# EAGLE design demon_ test (EAGLE 9.6.2)
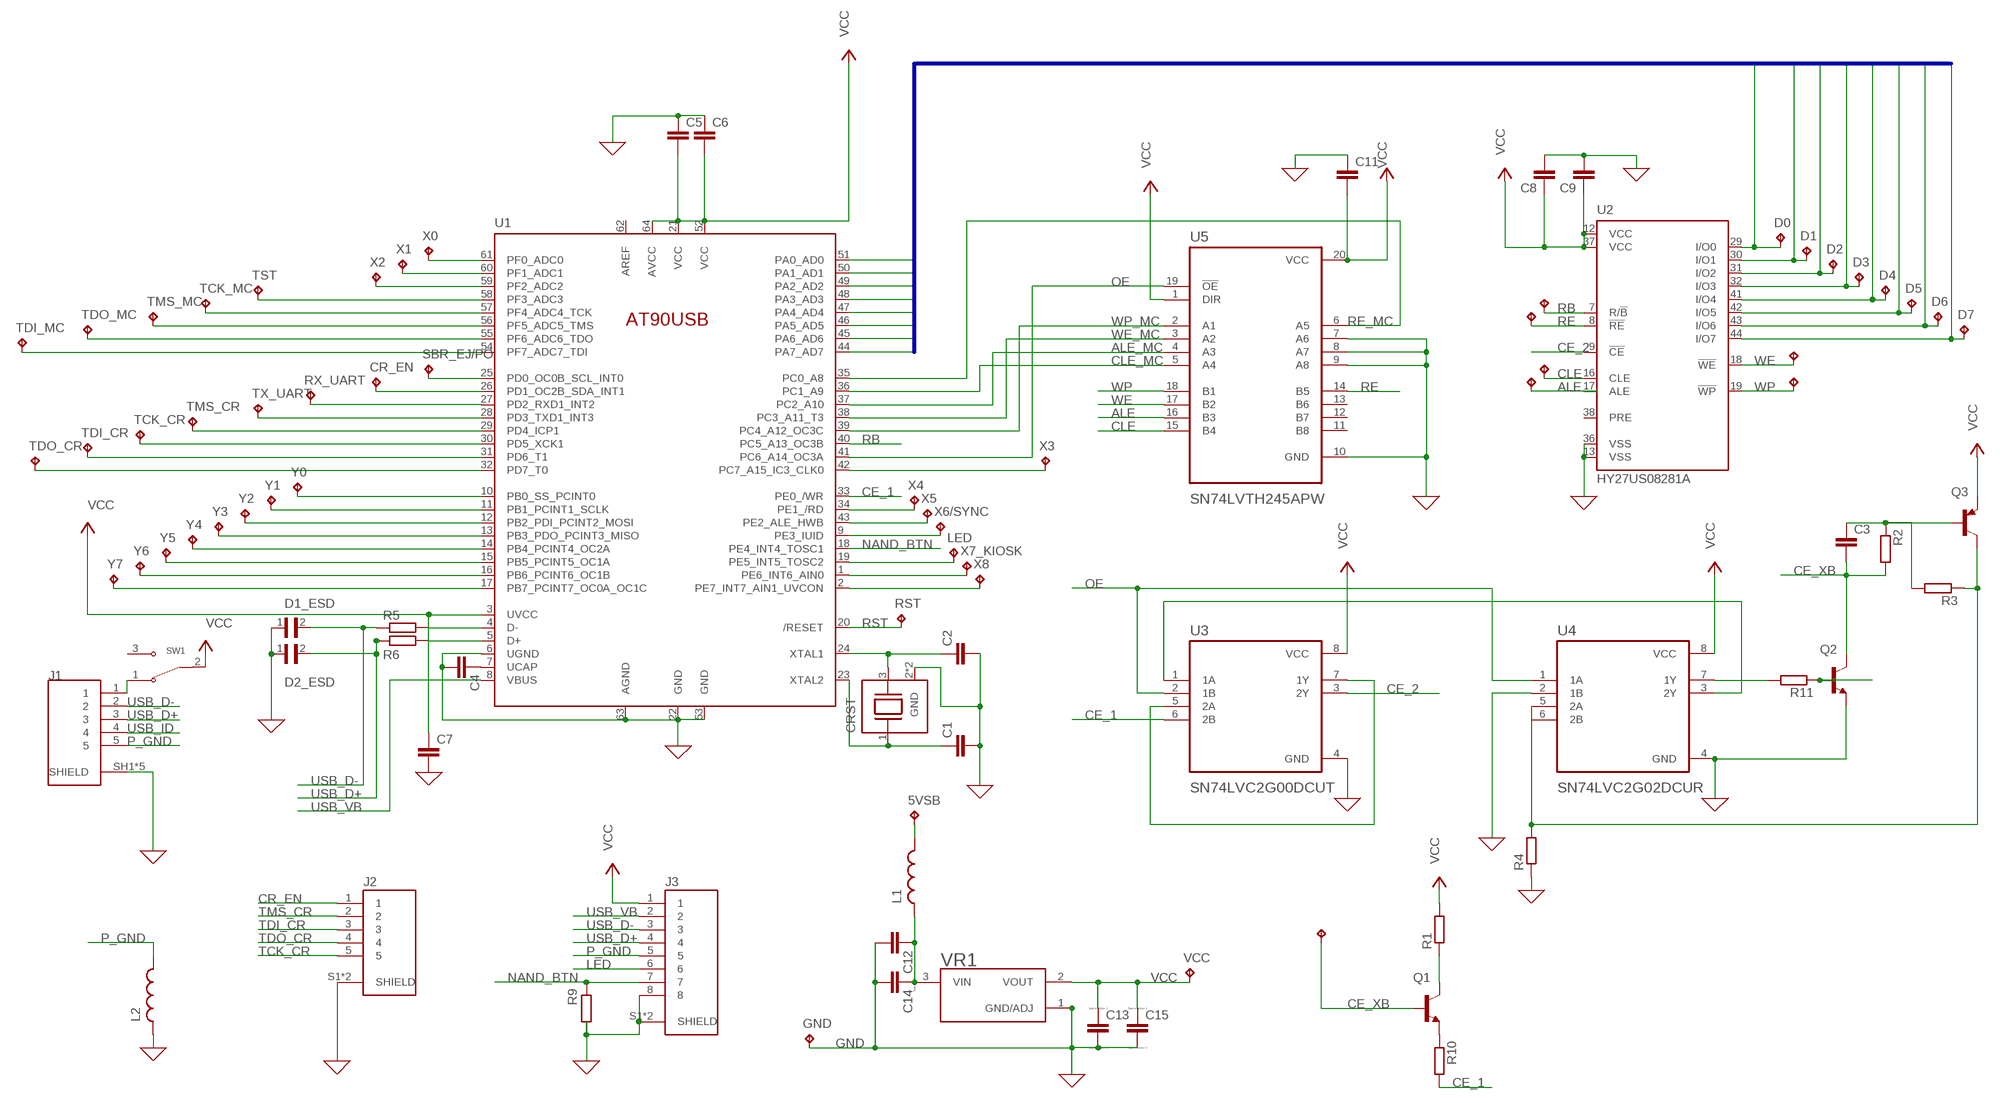
[diagram p0: schematic, sheet 1]

## Parts
5VSB  TPTP20R  [TP20R]
ALE1  TPTP15R  [TP15R]
C1  18pf  C-EUC0603  [C0603]
C2  18pf  C-EUC0603  [C0603]
C3  47pf  C-EUC0603  [C0603]
C4  1uf  C-EUC0603  [C0603]
C5  .1uf  C-EUC0603  [C0603]
C6  .1uf  C-EUC0603  [C0603]
C7  .1uf  C-EUC0603  [C0603]
C8  .1uf  C-EUC0603  [C0603]
C9  .1uf  C-EUC0603  [C0603]
C11  1uf  C-EUC0603  [C0603]
C12  .1uf  C-EUC0603  [C0603]
C13  2.2uf tant  CC2012  [C2012]
C14  1uf tant  CC2012  [C2012]
C15  10uf Tant  CC2012  [C2012]
CE  TPTP15R  [TP15R]
CLE1  TPTP15R  [TP15R]
CR_EN  TPTP15R  [TP15R]
CRST  ABMM2-8.000MHZ-E2-T  [XTAL_ABMM2-8.000MHZ-E2-T]
D0  TPTP15R  [TP15R]
D1  TPTP15R  [TP15R]
D1_ESD  PGB1010603  [ESD_PGB1010603MR]
D2  TPTP15R  [TP15R]
D2_ESD  PGB1010603  [ESD_PGB1010603MR]
D3  TPTP15R  [TP15R]
D4  TPTP15R  [TP15R]
D5  TPTP15R  [TP15R]
D6  TPTP15R  [TP15R]
D7  TPTP15R  [TP15R]
GND  TPTP15R  [TP15R]
J1  UJ2-MIBH2-4-SMT  [CUI_UJ2-MIBH2-4-SMT]
J2  FFC3B07-05-T  [GCT_FFC3B07-05-T]
J3  FFC3B07-08-T  [GCT_FFC3B07-08-T]
L1  LQW2BAS6N8J00L  [INDC2015X152N]
L2  LQW2BAS6N8J00L  [INDC2015X152N]
LED  TPTP15R  [TP15R]
Q1  BC846  [SOT23]
Q2  BC846  [SOT23]
Q3  bc856  BC856A-PNP-SOT23-BEC  [SOT23-BEC]
R1  22R 5%  R-EU_R0603  [R0603]
R2  470R 5%  R-EU_R0603  [R0603]
R3  2k7R 5%  R-EU_R0603  [R0603]
R4  330R 5%  R-EU_R0603  [R0603]
R5  22r 5%  R-EU_R0603  [R0603]
R6  22R 5%  R-EU_R0603  [R0603]
R9  10kR 5%  R-EU_R0603  [R0603]
R10  68R 5%  R-EU_R0603  [R0603]
R11  680R 5%  R-EU_R0603  [R0603]
RB1  TPTP15R  [TP15R]
RE  TPTP15R  [TP15R]
RST  TPTP15R  [TP15R]
RX_UART  TPTP15R  [TP15R]
SBR_EJ/PO  TPTP15R  [TP15R]
SW1  EG1215AA  [SW_EG1215AA]
TCK_CR  TPTP15R  [TP15R]
TCK_MC  TPTP15R  [TP15R]
TDI_CR  TPTP15R  [TP15R]
TDI_MC  TPTP15R  [TP15R]
TDO_CR  TPTP15R  [TP15R]
TDO_MC  TPTP15R  [TP15R]
TMS_CR  TPTP15R  [TP15R]
TMS_MC  TPTP15R  [TP15R]
TST  TPTP15R  [TP15R]
TX_UART  TPTP15R  [TP15R]
U1  AT90USB-QFN  [QFN64]
U2  HY27US08281A  [TSOP48]
U3  SN74LVC2G00DCUT  [SOP50P310X90-8N]
U4  SN74LVC2G02DCUR  [SOP50P310X90-8N]
U5  SN74LVTH245APW  [SOP65P640X120-20N]
VCC  TPTP15R  [TP15R]
VR1  AMS1117-3.3  [SOT229P700X180-4N]
WE1  TPTP15R  [TP15R]
WP1  TPTP15R  [TP15R]
X0  TPTP15R  [TP15R]
X1  TPTP15R  [TP15R]
X2  TPTP15R  [TP15R]
X3  TPTP15R  [TP15R]
X4  TPTP15R  [TP15R]
X5  TPTP15R  [TP15R]
X6/SYNC  TPTP15R  [TP15R]
X7_KIOSK  TPTP15R  [TP15R]
X8  TPTP15R  [TP15R]
Y0  TPTP15R  [TP15R]
Y1  TPTP15R  [TP15R]
Y2  TPTP15R  [TP15R]
Y3  TPTP15R  [TP15R]
Y4  TPTP15R  [TP15R]
Y5  TPTP15R  [TP15R]
Y6  TPTP15R  [TP15R]
Y7  TPTP15R  [TP15R]

## Nets
0: C7.2 U5.7(A6) U5.8(A7) U5.9(A8) U5.10(GND) ; supply symbol labelled GND
ALE: ALE1.TP U2.17(ALE) U5.16(B3)
ALE_MC: U1.37(PC2_A10) U5.4(A3)
CE_1: R10.2 U1.33(PE0_/WR) U3.6(2B)
CE_2: U2.9(!CE) U3.3(2Y)
CE_XB: C3.2 CE.TP Q1.1(B) Q2.3(C) R2.2
CLE: CLE1.TP U2.16(CLE) U5.15(B4)
CLE_MC: U1.36(PC1_A9) U5.5(A4)
CR_EN: CR_EN.TP J2.1 U1.26(PD1_OC2B_SDA_INT1)
D0: D0.TP U1.51(PA0_AD0) U2.29(I/O0)
D1: D1.TP U1.50(PA1_AD1) U2.30(I/O1)
D2: D2.TP U1.49(PA2_AD2) U2.31(I/O2)
D3: D3.TP U1.48(PA3_AD3) U2.32(I/O3)
D4: D4.TP U1.47(PA4_AD4) U2.41(I/O4)
D5: D5.TP U1.46(PA5_AD5) U2.42(I/O5)
D6: D6.TP U1.45(PA6_AD6) U2.43(I/O6)
D7: D7.TP U1.44(PA7_AD7) U2.44(I/O7)
F_5VSB: C12.1 C14.1 L1.1 VR1.3(VIN)
GND: C1.2 C2.2 C4.2 C5.1 C6.1 C8.2 C9.2 C11.1 C12.2 C13.2 C14.2 C15.2 CRST.2(GND) CRST.4(GND) D1_ESD.1 D2_ESD.1 GND.TP J1.SH1(SHIELD) J1.SH2(SHIELD) J1.SH3(SHIELD) J1.SH4(SHIELD) J1.SH5(SHIELD) J2.S1(SHIELD) J2.S2(SHIELD) J3.8 J3.S1(SHIELD) J3.S2(SHIELD) L2.1 Q2.2(E) R4.1 R9.2 U1.6(UGND) U1.22(GND) U1.53(GND) U1.63(AGND) U2.13(VSS) U2.36(VSS) U3.4(GND) U4.2(1B) U4.4(GND) VR1.1(GND/ADJ)
LED: J3.6 LED.TP U1.19(PE5_INT5_TOSC2)
N$1: R5.2 U1.4(D-)
N$2: C3.1 Q3.B R2.1 R3.2
N$3: C4.1 U1.7(UCAP)
N$4: R6.2 U1.5(D+)
N$6: Q1.3(C) R1.1
N$7: Q1.2(E) R10.1
N$8: 5VSB.TP L1.2
N$20: U3.5(2A) U3.7(1Y)
N$32: U3.1(1A) U4.3(2Y)
N$33: R11.2 U4.7(1Y)
N$34: Q2.1(B) R11.1
N$36: Q3.C R3.1 R4.2 U4.5(2A) U4.6(2B)
N$37: J1.1 SW1.1
NAND_BTN: J3.7 R9.1 U1.18(PE4_INT4_TOSC1)
OE: U1.41(PC6_A14_OC3A) U3.2(1B) U4.1(1A) U5.19(!OE)
P_GND: J1.5 J3.5 L2.2
RB: RB1.TP U1.40(PC5_A13_OC3B) U2.7(R/!B)
RE: RE.TP U2.8(!RE) U5.14(B5)
RE_MC: U1.35(PC0_A8) U5.6(A5)
RST: RST.TP U1.20(/RESET)
RX_UART: RX_UART.TP U1.27(PD2_RXD1_INT2)
SBR: SBR_EJ/PO.TP U1.25(PD0_OC0B_SCL_INT0)
TCK_CR: J2.5 TCK_CR.TP U1.30(PD5_XCK1)
TCK_MC: TCK_MC.TP U1.57(PF4_ADC4_TCK)
TD0_MC: TDO_MC.TP U1.55(PF6_ADC6_TDO)
TDI_CR: J2.3 TDI_CR.TP U1.31(PD6_T1)
TDI_MC: TDI_MC.TP U1.54(PF7_ADC7_TDI)
TDO_CR: J2.4 TDO_CR.TP U1.32(PD7_T0)
TMS_CR: J2.2 TMS_CR.TP U1.29(PD4_ICP1)
TMS_MC: TMS_MC.TP U1.56(PF5_ADC5_TMS)
TST: TST.TP U1.58(PF3_ADC3)
TX_UART: TX_UART.TP U1.28(PD3_TXD1_INT3)
USB_D+: D2_ESD.2 J1.3 J3.4 R6.1
USB_D-: D1_ESD.2 J1.2 J3.3 R5.1
USB_ID: J1.4
USB_VB: J3.2 U1.8(VBUS)
VCC: C5.2 C6.2 C7.1 C8.1 C9.1 C11.2 C13.1 C15.1 J3.1 Q3.E R1.2 SW1.2 U1.3(UVCC) U1.21(VCC) U1.52(VCC) U1.64(AVCC) U2.12(VCC) U2.37(VCC) U3.8(VCC) U4.8(VCC) U5.1(DIR) U5.20(VCC) VCC.TP VR1.2(VOUT)
WE: U2.18(!WE) U5.17(B2) WE1.TP
WE_MC: U1.38(PC3_A11_T3) U5.3(A2)
WP: U2.19(!WP) U5.18(B1) WP1.TP
WP_MC: U1.39(PC4_A12_OC3C) U5.2(A1)
X0: U1.61(PF0_ADC0) X0.TP
X1: U1.60(PF1_ADC1) X1.TP
X2: U1.59(PF2_ADC2) X2.TP
X3: U1.42(PC7_A15_IC3_CLK0) X3.TP
X4: U1.34(PE1_/RD) X4.TP
X5: U1.43(PE2_ALE_HWB) X5.TP
X6/SYNC: U1.9(PE3_IUID) X6/SYNC.TP
X7: U1.1(PE6_INT6_AIN0) X7_KIOSK.TP
X8: U1.2(PE7_INT7_AIN1_UVCON) X8.TP
XTAL1: C2.1 CRST.3 U1.24(XTAL1)
XTAL2: C1.1 CRST.1 U1.23(XTAL2)
Y0: U1.10(PB0_SS_PCINT0) Y0.TP
Y1: U1.11(PB1_PCINT1_SCLK) Y1.TP
Y2: U1.12(PB2_PDI_PCINT2_MOSI) Y2.TP
Y3: U1.13(PB3_PDO_PCINT3_MISO) Y3.TP
Y4: U1.14(PB4_PCINT4_OC2A) Y4.TP
Y5: U1.15(PB5_PCINT5_OC1A) Y5.TP
Y6: U1.16(PB6_PCINT6_OC1B) Y6.TP
Y7: U1.17(PB7_PCINT7_OC0A_OC1C) Y7.TP
Unconnected: SW1.3 U2.38(PRE) U5.11(B8) U5.12(B7) U5.13(B6)

## Buses
NAND_ADDRESS_BUS:D0,D1,D2,D3,D4,D5,D6,D7

## Power pins joined to a net without a drawn wire
AREF: U1.62(AREF)

## Library data of the parts
5VSB ALE1 CE CLE1 CR_EN D0 D1-D7 GND LED RB1 RE RST RX_UART SBR_EJ/PO TCK_CR TCK_MC TDI_CR TDI_MC TDO_CR TDO_MC TMS_CR TMS_MC TST TX_UART VCC WE1 WP1 X0 X1-X5 X6/SYNC X7_KIOSK X8 Y0 Y1-Y7 = testpad:TP: Test pad
C1-C9 C11 C12 = rcl:C-EU: CAPACITOR, European symbol; SPICEPREFIX: C
C13-C15 = eagle-ltspice:C: CAPACITOR, European symbol; SPICEMODEL: NONE; SPICEPREFIX: C
CRST = ABMM2-8.000MHZ-E2-T:ABMM2-8.000MHZ-E2-T: Check availability <https://pricing.snapeda.com/parts/ABMM2-8.000MHZ-E2-T/Abracon/view-part?ref=eda>; AVAILABILITY: In Stock; DESCRIPTION: 8 MHz ±20ppm Crystal 18pF 72 Ohms 4-SMD, No Lead; MF: Abracon; MP: ABMM2-8.000MHZ-E2-T; PACKAGE: SMD-4 Abracon; PRICE: None; PURCHASE-URL: https://pricing.snapeda.com/search/part/ABMM2-8.000MHZ-E2-T/?ref=eda
D1_ESD D2_ESD = PGB1010603:PGB1010603: DIODE, TVS; No. of Pins:2; SVHC:No SVHC (18-Jun-2012); Capacitance Cd @ Vr Typ:0.06pF; Diode Type:TVS; Package / Case:0603; Stand-off Voltage:24V; Termination Type:SMD Check availability <https://pricing.snapeda.com/parts/PGB1010603/Littelfuse%20Inc./view-part?ref=eda>; AVAILABILITY: In Stock; DESCRIPTION: 150V (Typ) Clamp - Ipp Tvs Diode Surface Mount 0603 (1608 Metric); MF: Littelfuse Inc.; MP: PGB1010603; PACKAGE: 0603 Littelfuse Inc.; PRICE: None; PURCHASE-URL: https://pricing.snapeda.com/search/part/PGB1010603/?ref=eda
J1 = UJ2-MIBH2-4-SMT:UJ2-MIBH2-4-SMT: Micro B, USB 2.0, 1.8 A, Right Angle, Surface Mount (SMT), USB Receptacle Check availability <https://pricing.snapeda.com/parts/UJ2-MIBH2-4-SMT/CUI%20Devices/view-part?ref=eda>; AVAILABILITY: In Stock; CUI_PURCHASE_URL: https://www.cuidevices.com/product/interconnect/connectors/usb-connectors/uj2-mibh2-4-smt?utm_source=snapeda.com&utm_medium=referral&utm_campaign=snapedaBOM; DESCRIPTION: Micro B, USB 2.0, 1.8 A, Right Angle, Surface Mount (SMT), USB Receptacle; MF: CUI Devices; MP: UJ2-MIBH2-4-SMT; PACKAGE: None; PRICE: None; PURCHASE-URL: https://pricing.snapeda.com/search/part/UJ2-MIBH2-4-SMT/?ref=eda
J2 = FFC3B07-05-T:FFC3B07-05-T: FPC 1.0mm Pitch, Side entry, Top contact, SMT, Height 2.5mm, Slide type Check availability <https://pricing.snapeda.com/parts/FFC3B07-05-T/Global%20Connector%20Technology/view-part?ref=eda>; AVAILABILITY: In Stock; DESCRIPTION: 5 Position FFC, FPC Connector Contacts, Bottom 0.039 (1.00mm) Surface Mount, Right Angle; MF: Global Connector Technology; MP: FFC3B07-05-T; PACKAGE: None; PRICE: None; PURCHASE-URL: https://pricing.snapeda.com/search/part/FFC3B07-05-T/?ref=eda
J3 = FFC3B07-08-T:FFC3B07-08-T: FPC 1.0mm Pitch, Side entry, Top contact, SMT, Height 2.5mm, Slide type Check availability <https://pricing.snapeda.com/parts/FFC3B07-08-T/Global%20Connector%20Technology/view-part?ref=eda>; AVAILABILITY: In Stock; DESCRIPTION: 8 Position FFC, FPC Connector Contacts, Bottom 0.039 (1.00mm) Surface Mount, Right Angle; MF: Global Connector Technology; MP: FFC3B07-08-T; PACKAGE: None; PRICE: None; PURCHASE-URL: https://pricing.snapeda.com/search/part/FFC3B07-08-T/?ref=eda
L1 L2 = LQW2BAS6N8J00L:LQW2BAS6N8J00L: Ind RF Chip Wirewound 6.8nH 5% 250MHz 50Q-Factor 600mA 0805 Embossed T/R Check availability <https://pricing.snapeda.com/parts/LQW2BAS6N8J00L/Murata/view-part?ref=eda>; AVAILABILITY: In Stock; DESCRIPTION: Inductor with Inductance: 6.8nH Tol. +/-5%, Package: 0805 (2015); MF: Murata; MP: LQW2BAS6N8J00L; PACKAGE: 2015 Murata; PRICE: None; PURCHASE-URL: https://pricing.snapeda.com/search/part/LQW2BAS6N8J00L/?ref=eda
Q1 Q2 = transistor:BC846: NPN TRANSISTOR
Q3 = transistor:*-PNP-: PNP Transistror
R1-R6 R9-R11 = resistor:R-EU_: RESISTOR, European symbol
SW1 = EG1215AA:EG1215AA: Slide Switch SPDT Surface Mount, Right Angle Check availability <https://pricing.snapeda.com/parts/EG1215AA/E-Switch/view-part?ref=eda>; AVAILABILITY: In Stock; DESCRIPTION: Slide Switch SPDT Surface Mount, Right Angle; MF: E-Switch; MP: EG1215AA; PACKAGE: None; PRICE: None; PURCHASE-URL: https://pricing.snapeda.com/search/part/EG1215AA/?ref=eda
U1 = controller-micro_atmel_jd:AT90USB
U2 = memory-hynix:HY27US08281A: HYNIX NAND FLASH HY27US08281A 16Mx8bit with spare 4M bit capacity. Source: http://www.hynix.com/datasheet/pdf/flash/HY27US(08_16)281A%20Series(Rev0.6).pdf
U3 = SN74LVC2G00DCUT:SN74LVC2G00DCUT: Check availability <https://pricing.snapeda.com/parts/SN74LVC2G00DCUT/Texas%20Instruments/view-part?ref=eda>; AVAILABILITY: In Stock; DESCRIPTION: 2-ch, 2-input, 1.65-V to 5.5-V NAND gates; MF: Texas Instruments; MP: SN74LVC2G00DCUT; PACKAGE: VSSOP-8 Texas Instruments; PRICE: None; PURCHASE-URL: https://pricing.snapeda.com/search/part/SN74LVC2G00DCUT/?ref=eda
U4 = SN74LVC2G02DCUR:SN74LVC2G02DCUR: Check availability <https://pricing.snapeda.com/parts/SN74LVC2G02DCUR/Texas%20Instruments/view-part?ref=eda>; AVAILABILITY: In Stock; DESCRIPTION: 2-ch, 2-input, 1.65-V to 5.5-V NOR gates; MF: Texas Instruments; MP: SN74LVC2G02DCUR; PACKAGE: VSSOP-8 Texas Instruments; PRICE: None; PURCHASE-URL: https://pricing.snapeda.com/search/part/SN74LVC2G02DCUR/?ref=eda
U5 = SN74LVTH245APW:SN74LVTH245APW: Check availability <https://pricing.snapeda.com/parts/SN74LVTH245APW/Texas%20Instruments/view-part?ref=eda>; AVAILABILITY: In Stock; DESCRIPTION: 3.3-V ABT Octal Bus Transceivers With 3-State Outputs; MF: Texas Instruments; MP: SN74LVTH245APW; PACKAGE: TSSOP-20 Texas Instruments; PRICE: None; PURCHASE-URL: https://pricing.snapeda.com/search/part/SN74LVTH245APW/?ref=eda
VR1 = AMS1117-3.3:AMS1117-3.3: Check availability <https://pricing.snapeda.com/parts/AMS1117-3.3/Advanced%20Monolithic%20Systems/view-part?ref=eda>; AVAILABILITY: In Stock; DESCRIPTION: Sot223/Pkg 1-Amp 3.3-Volt Low Drop Out Voltage Regulatator; MF: Advanced Monolithic Systems; MP: AMS1117-3.3; PACKAGE: SOT-223 Seeed Technology; PRICE: None; PURCHASE-URL: https://pricing.snapeda.com/search/part/AMS1117-3.3/?ref=eda

## Board
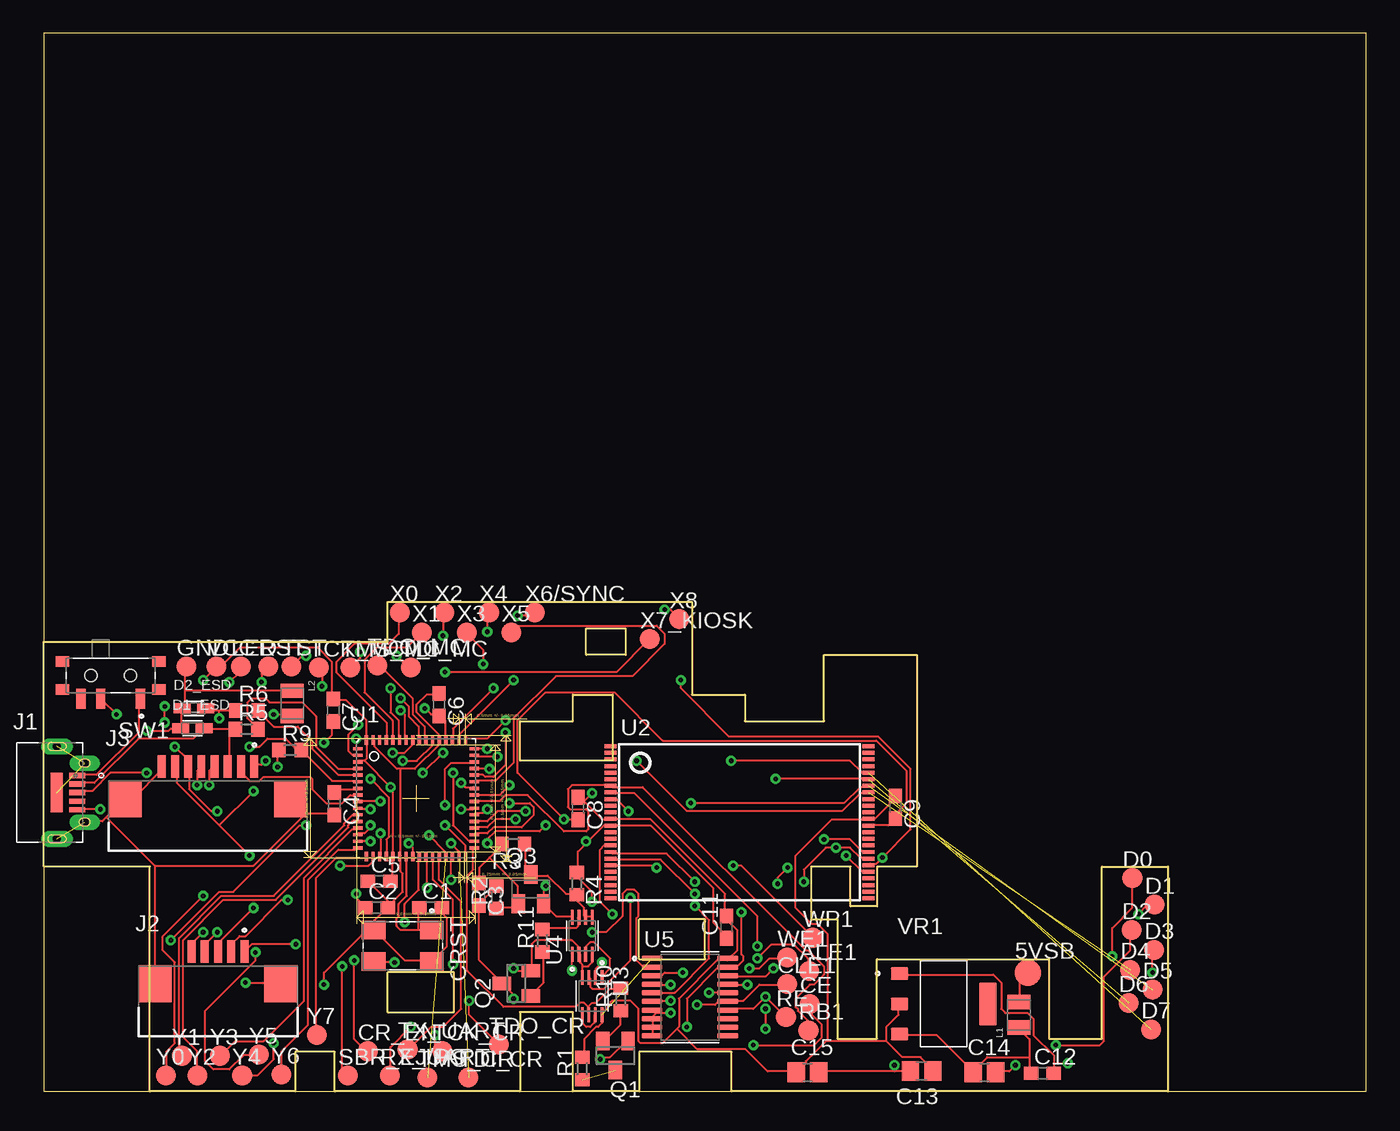
[diagram p1: board, top side]
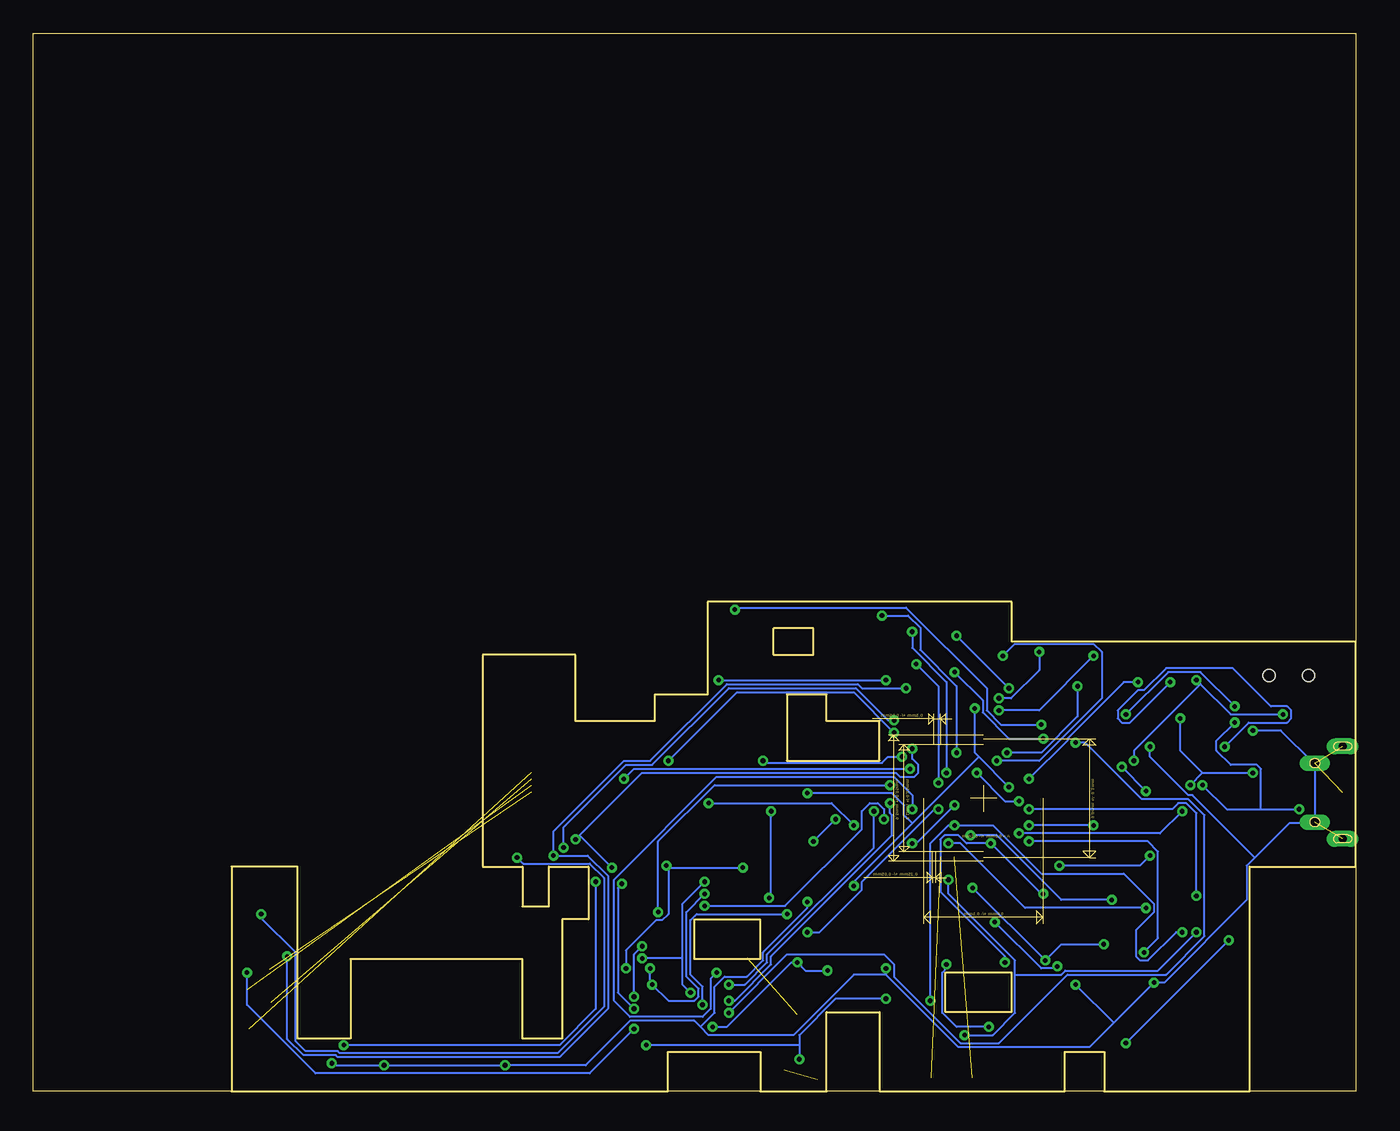
[diagram p2: board, bottom side, seen from below]

Size 100 x 80 mm. Coordinates in mm from the lower left corner, seen from the top.
Outline: 0,0 100,0 100,80 0,80 0,0
Copper layers (1*16): Top 0.035mm / dielectric 1.5mm / Bottom 0.035mm
Design rules "default": minimum track width 6mil, minimum drill 0.35mm, track to track 6mil, track to pad 6mil, pad to pad 6mil, via to via 6mil, smd to smd 6mil, copper to edge 40mil, drill to drill 6mil, minimum pad ring 10mil, minimum via ring 8mil, stop-mask expansion 4mil, vias tented up to drill 0mil, thermal gap 10mil
tRestrict: 61 lines
bRestrict: 60 lines
Milling: 60 lines

### Footprints (pad centres in the part's own frame; a part is rotated, then mirrored left to right if it is on the bottom)
TP20R = smd 2 x 2: TP 0,0
TP15R = smd 1.5 x 1.5: TP 0,0
C0603 = smd 1.1 x 1: 1 -0.85,0; 2 0.85,0
C2012 = smd 1.3 x 1.5: 1 -0.85,0; 2 0.85,0
XTAL_ABMM2-8.000MHZ-E2-T = smd 1.4 x 1.8: 1 -1.2,2.2; 2 -1.2,-2.2; 3 1.2,-2.2; 4 1.2,2.2
ESD_PGB1010603MR = smd 1.27 x 0.76: 1 -0.89,0; 2 0.89,0
CUI_UJ2-MIBH2-4-SMT = smd 1.2 x 0.4: 1 0,0; 2 0,-0.65; 3 0,-1.3; 4 0,-1.95; 5 0,-2.6 | drill 0.6 pad 1.2 long: SH1 -1.55,2.2; SH4 -1.55,-4.8 | drill 0.65 pad 1.05 long: SH2 0.55,0.925; SH5 0.55,-3.525 | smd 0.9 x 3: SH3 -1.55,-1.3
GCT_FFC3B07-05-T = smd 0.6 x 1.7: 1 2,2.45; 2 1,2.45; 3 0,2.45; 4 -1,2.45; 5 -2,2.45 | smd 2.5 x 2.8: S1 4.75,0; S2 -4.75,0
GCT_FFC3B07-08-T = smd 0.6 x 1.7: 1 3.5,2.45; 2 2.5,2.45; 3 1.5,2.45; 4 0.5,2.45; 5 -0.5,2.45; 6 -1.5,2.45; 7 -2.5,2.45; 8 -3.5,2.45 | smd 2.5 x 2.8: S1 6.25,0; S2 -6.25,0
INDC2015X152N = smd 1.09 x 1.75: 1 -0.959,0; 2 0.959,0
SOT23 = smd 1 x 1.4: 1 -0.95,-1.1; 2 0.95,-1.1; 3 0,1.1
SOT23-BEC = smd 1 x 1.4: B -0.95,-1.1; C 0,1.1; E 0.95,-1.1
R0603 = smd 1 x 1.1: 1 -0.85,0; 2 0.85,0
SW_EG1215AA = smd 0.7 x 1.5: 1 -2.25,1.75; 2 0.75,1.75; 3 2.25,1.75 | smd 1 x 0.8: S1 -3.65,1.05; S2 -3.65,-1.05; S3 3.65,-1.05; S4 3.65,1.05 | hole 0.9: -1.5,0; 1.5,0
QFN64 = smd 0.7 x 0.25: 1 -4.4,3.75; 2 -4.4,3.25; 3 -4.4,2.75; 4 -4.4,2.25; 5 -4.4,1.75; 6 -4.4,1.25; 7 -4.4,0.75; 8 -4.4,0.25; 9 -4.4,-0.25; 10 -4.4,-0.75; 11 -4.4,-1.25; 12 -4.4,-1.75; 13 -4.4,-2.25; 14 -4.4,-2.75; 15 -4.4,-3.25; 16 -4.4,-3.75; 33 4.4,-3.75; 34 4.4,-3.25; 35 4.4,-2.75; 36 4.4,-2.25; 37 4.4,-1.75; 38 4.4,-1.25; 39 4.4,-0.75; 40 4.4,-0.25; 41 4.4,0.25; 42 4.4,0.75; 43 4.4,1.25; 44 4.4,1.75; 45 4.4,2.25; 46 4.4,2.75; 47 4.4,3.25; 48 4.4,3.75 | smd 0.25 x 0.7: 17 -3.75,-4.4; 18 -3.25,-4.4; 19 -2.75,-4.4; 20 -2.25,-4.4; 21 -1.75,-4.4; 22 -1.25,-4.4; 23 -0.75,-4.4; 24 -0.25,-4.4; 25 0.25,-4.4; 26 0.75,-4.4; 27 1.25,-4.4; 28 1.75,-4.4; 29 2.25,-4.4; 30 2.75,-4.4; 31 3.25,-4.4; 32 3.75,-4.4; 49 3.75,4.4; 50 3.25,4.4; 51 2.75,4.4; 52 2.25,4.4; 53 1.75,4.4; 54 1.25,4.4; 55 0.75,4.4; 56 0.25,4.4; 57 -0.25,4.4; 58 -0.75,4.4; 59 -1.25,4.4; 60 -1.75,4.4; 61 -2.25,4.4; 62 -2.75,4.4; 63 -3.25,4.4; 64 -3.75,4.4
TSOP48 = smd 0.9 x 0.3: 1 -9.75,5.75; 2 -9.75,5.25; 3 -9.75,4.75; 4 -9.75,4.25; 5 -9.75,3.75; 6 -9.75,3.25; 7 -9.75,2.75; 8 -9.75,2.25; 9 -9.75,1.75; 10 -9.75,1.25; 11 -9.75,0.75; 12 -9.75,0.25; 13 -9.75,-0.25; 14 -9.75,-0.75; 15 -9.75,-1.25; 16 -9.75,-1.75; 17 -9.75,-2.25; 18 -9.75,-2.75; 19 -9.75,-3.25; 20 -9.75,-3.75; 21 -9.75,-4.25; 22 -9.75,-4.75; 23 -9.75,-5.25; 24 -9.75,-5.75; 25 9.75,-5.75; 26 9.75,-5.25; 27 9.75,-4.75; 28 9.75,-4.25; 29 9.75,-3.75; 30 9.75,-3.25; 31 9.75,-2.75; 32 9.75,-2.25; 33 9.75,-1.75; 34 9.75,-1.25; 35 9.75,-0.75; 36 9.75,-0.25; 37 9.75,0.25; 38 9.75,0.75; 39 9.75,1.25; 40 9.75,1.75; 41 9.75,2.25; 42 9.75,2.75; 43 9.75,3.25; 44 9.75,3.75; 45 9.75,4.25; 46 9.75,4.75; 47 9.75,5.25; 48 9.75,5.75
SOP50P310X90-8N = smd 1.12 x 0.27: 1 -1.405,0.75; 2 -1.405,0.25; 3 -1.405,-0.25; 4 -1.405,-0.75; 5 1.405,-0.75; 6 1.405,-0.25; 7 1.405,0.25; 8 1.405,0.75
SOP65P640X120-20N = smd 1.57 x 0.41: 1 -2.87,2.925; 2 -2.87,2.275; 3 -2.87,1.625; 4 -2.87,0.975; 5 -2.87,0.325; 6 -2.87,-0.325; 7 -2.87,-0.975; 8 -2.87,-1.625; 9 -2.87,-2.275; 10 -2.87,-2.925; 11 2.87,-2.925; 12 2.87,-2.275; 13 2.87,-1.625; 14 2.87,-0.975; 15 2.87,-0.325; 16 2.87,0.325; 17 2.87,0.975; 18 2.87,1.625; 19 2.87,2.275; 20 2.87,2.925
SOT229P700X180-4N = smd 1.31 x 0.93: 1 -3.345,2.29; 2 -3.345,0; 3 -3.345,-2.29 | smd 1.31 x 3.24: 4 3.345,0

### Placement (x,y rotation side)
5VSB  74.41,8.96 0 top
ALE1  57.87,9.12 0 top
C1  29.25,13.88 0 top
C2  25.17,13.88 0 top
C3  32.88,14.91 270 top
C4  21.96,21.74 270 top
C5  25.35,15.88 0 top
C6  29.88,29.23 270 top
C7  21.88,28.81 270 top
C8  40.38,21.39 270 top
C9  64.38,21.47 270 top
C11  51.62,12.43 90 top
C12  75.51,1.38 0 top
C13  66.37,1.55 180 top
C14  71.12,1.45 0 top
C15  57.74,1.45 0 top
CE  57.92,6.62 0 top
CLE1  56.22,8.12 0 top
CR_EN  24.49,3.04 0 top
CRST  27.13,11.01 270 top
D0  82.3,16.12 0 top
D1  83.99,14.12 0 top
D1_ESD  11.23,27.45 0 top
D2  82.26,12.2 0 top
D2_ESD  11.34,28.95 0 top
D3  83.95,10.7 0 top
D4  82.14,9.2 0 top
D5  83.83,7.7 0 top
D6  82.02,6.7 0 top
D7  83.71,4.7 0 top
GND  10.79,32.12 0 top
J1  2.53,23.89 0 top
J2  13.17,8.13 0 top
J3  12.41,22.13 0 top
L1  73.72,5.79 90 top
L2  18.78,29.33 270 top
LED  14.89,32.12 0 top
Q1  43.21,2.71 180 top
Q2  35.71,8.17 90 top
Q3  36.82,15.29 0 top
R1  40.7,1.73 90 top
R2  34.2,14.68 90 top
R3  35.49,18.7 180 top
R4  40.3,15.71 270 top
R5  15.33,27.38 0 top
R6  15.34,28.8 0 top
R9  18.62,25.8 0 top
R10  43.62,6.95 90 top
R11  37.7,11.4 90 top
RB1  57.81,4.62 0 top
RE  56.11,5.62 0 top
RST  16.97,32.12 0 top
RX_UART  26.16,1.19 0 top
SBR_EJ/PO  22.98,1.19 0 top
SW1  5.05,31.44 180 top
TCK_CR  30.12,3.04 0 top
TCK_MC  20.79,32.04 0 top
TDI_CR  32.11,1.04 0 top
TDI_MC  27.73,32.04 0 top
TDO_CR  34.4,3.54 0 top
TDO_MC  25.22,32.19 0 top
TMS_CR  29.01,1.04 0 top
TMS_MC  23.18,32.04 0 top
TST  18.73,32.12 0 top
TX_UART  27.5,3.19 0 top
U1  28.14,22.16 0 top
U2  52.59,20.35 0 top
U3  41.45,7.21 270 top
U4  40.71,11.77 90 top
U5  48.85,7.13 0 top
VCC  13.05,32.12 0 top
VR1  68.04,6.62 0 top
WE1  56.21,10.12 0 top
WP1  58.13,11.62 0 top
X0  26.9,36.2 0 top
X1  28.59,34.7 0 top
X2  30.28,36.2 0 top
X3  31.97,34.7 0 top
X4  33.66,36.2 0 top
X5  35.35,34.7 0 top
X6/SYNC  37.11,36.19 0 top
X7_KIOSK  45.82,34.19 0 top
X8  48.04,35.7 0 top
Y0  9.23,1.2 0 top
Y1  10.42,2.7 0 top
Y2  11.61,1.2 0 top
Y3  13.3,2.7 0 top
Y4  14.99,1.2 0 top
Y5  16.26,2.78 0 top
Y6  17.95,1.28 0 top
Y7  20.64,4.28 0 top

### Tracks (layer width: path | path; a pad name or v marks a point on that pad's centre or on a via)
0  (via drill 0.35)
  Top 0.152: U5.10 46.02,4.27 46.02,4.72 U5.9 46.02,4.88 46.02,5.49 U5.8 46.02,5.64 46.33,5.94 | v21.18,26.36 21.79,26.98 21.79,27.89 C7.2 | 46.33,5.94 46.18,5.94 46.02,6.1 U5.7 | 46.33,5.94 v47.4,5.94
  Bottom 0.152: v21.18,26.36 20.42,26.36 16.15,22.1 12.65,22.1 11.43,20.88 11.43,11.73 14.33,8.84 21.79,8.84 26.98,3.66 29.87,3.66 34.9,8.69 34.9,9.6 35.66,10.36 42.98,10.36 v47.4,5.94
ALE  (via drill 0.35)
  Top 0.152: v49.23,15.85 47.09,17.98 42.98,17.98 U2.17 | v50.29,7.47 51.66,7.47 U5.16 | v53.95,10.06 55.02,11.12 56.69,11.12 57.76,10.06 57.76,9.14 ALE1.TP
  Bottom 0.152: v49.23,15.85 50.9,14.17 50.9,10.06 | 50.9,10.06 50.9,8.08 v50.29,7.47 | 50.9,10.06 v53.95,10.06
ALE_MC  (via drill 0.35)
  Top 0.152: v36.42,21.18 34.29,21.18 33.53,20.42 32.61,20.42 U1.37 | v47.4,8.08 46.02,8.08 U5.4
  Bottom 0.152: v36.42,21.18 36.42,18.44 44.5,10.36 44.5,9.75 46.18,8.08 v47.4,8.08
CE_1
  Top 0.152: 41.15,6.4 40.84,6.71 40.54,6.71 40.23,6.4 34.75,6.4 32,9.14 32,16.31 32.46,16.76 32.46,18.29 U1.33 | 41.15,6.4 41.15,5.94 U3.6 | 41.15,6.4 41.45,6.71 41.76,6.71 42.82,7.77 43.59,7.77 R10.2
CE_2  (via drill 0.35)
  Top 0.152: v44.2,21.18 43.28,22.1 42.98,22.1 U2.9 | v44.35,14.63 44.35,9.91 42.67,8.23 42.67,8.08 42.37,7.77 41.45,7.77 41.3,7.92 41.3,8.53 U3.3
  Bottom 0.152: v44.2,21.18 44.2,14.78 v44.35,14.63
CE_XB  (via drill 0.35)
  Top 0.152: R2.2 34.14,15.39 32.92,14.17 C3.2 32.92,14.02 32.92,9.91 34.59,8.23 Q2.3 34.75,8.08 35.51,7.32 v35.51,7.01 | v42.06,2.44 42.22,2.59 42.82,2.59 44.04,3.81 Q1.1 | v53.65,3.5 58.22,3.5 58.83,4.12 58.83,5.03 58.06,5.79 58.06,6.55 CE.TP
  Bottom 0.152: 42.06,3.5 42.06,4.27 39.32,7.01 v35.51,7.01 | 42.06,3.5 v42.06,2.44 | 42.06,3.5 v53.65,3.5
CLE  (via drill 0.35)
  Top 0.152: v42.98,13.41 42.06,14.33 42.06,18.29 42.37,18.59 42.82,18.59 U2.16 | v49.38,6.55 50.75,6.55 50.9,6.71 51.66,6.71 U5.15 51.82,6.86 52.88,6.86 54.1,8.08 56.08,8.08 CLE1.TP
  Bottom 0.152: v42.98,13.41 49.84,13.41 50.29,12.95 50.29,8.84 49.38,7.92 v49.38,6.55
CLE_MC  (via drill 0.35)
  Top 0.152: v35.66,20.57 34.14,20.57 33.53,19.96 32.61,19.96 U1.36 | v49.23,14.02 50.29,12.95 50.29,10.06 47.7,7.47 46.02,7.47 U5.5
  Bottom 0.152: v35.66,20.57 35.66,21.34 36.12,21.79 36.73,21.79 37.34,21.18 37.34,19.81 43.13,14.02 v49.23,14.02
CR_EN  (via drill 0.35)
  Top 0.152: v28.96,15.39 28.96,17.68 U1.26 | v23.47,9.91 23.47,3.96 24.38,3.05 CR_EN.TP | v19.05,11.12 15.7,11.12 15.24,10.67 J2.1
  Bottom 0.152: v28.96,15.39 v23.47,9.91 22.25,11.12 v19.05,11.12
D0  (via drill 0.35)
  Top 0.152: v33.98,30.48 30.94,27.43 30.94,26.67 U1.51 | v60.66,17.83 61.87,16.61 62.33,16.61 U2.29 | v80.77,10.21 80.77,12.34 82.3,13.87 82.3,16 D0.TP
  Bottom 0.152: v33.98,30.48 37.34,30.48 37.64,30.79 47.55,30.79 53.34,24.99 55.32,24.99 60.66,19.66 v60.66,17.83 58.06,17.83 56.54,16.31 56.54,6.25 60.2,2.59 76.96,2.59 77.11,2.74 79.55,2.74 80.77,3.96 v80.77,10.21
D1  (via drill 0.35)
  Top 0.152: v35.51,31.09 31.39,26.98 31.39,26.67 U1.50 | v48.16,31.09 48.16,30.48 51.82,26.82 63.09,26.82 65.53,24.38 65.53,19.81 v63.4,17.68 62.94,17.22 62.48,17.22 U2.30 | v82.75,13.41 83.36,14.02 83.97,14.02 D1.TP
  Bottom 0.152: v48.16,31.09 v35.51,31.09 | v82.75,13.41 82.75,13.11 80.16,10.52 80.16,3.81 79.4,3.05 76.96,3.05 76.81,2.9 60.35,2.9 56.84,6.4 56.84,16.15 57.91,17.22 62.94,17.22 v63.4,17.68
D2  (via drill 0.35)
  Top 0.152: v34.9,28.04 33.53,26.67 32,26.67 U1.49 | U2.31 62.33,17.68 61.72,17.68 60.96,18.44 v59.89,18.44 59.13,18.44 57.45,16.76 v57.45,15.85 | v76.5,3.5 79.86,3.5 80.16,3.81 80.16,8.69 82.14,10.67 82.14,12.19 D2.TP
  Bottom 0.152: v34.9,28.04 35.36,28.04 37.8,30.48 47.4,30.48 53.19,24.69 55.17,24.69 59.89,19.96 v59.89,18.44 | v76.5,3.5 60.2,3.5 57.45,6.25 v57.45,15.85
D3  (via drill 0.35)
  Top 0.152: v33.53,25.91 32.61,25.91 U1.48 | v58.98,19.05 60.96,19.05 61.87,18.14 62.33,18.14 U2.32 | v83.82,8.99 83.82,10.67 D3.TP | v54.56,6.25 v54.56,4.72 | v55.47,15.7 55.47,16.15 v56.24,16.92
  Bottom 0.152: v33.53,25.91 33.53,25.15 33.07,24.69 33.07,24.08 33.38,23.77 34.44,23.77 34.75,24.08 53.95,24.08 58.67,19.36 | v58.98,19.05 58.67,19.36 | v83.82,8.99 83.82,6.55 78.64,1.37 57.91,1.37 v54.56,4.72 | v54.56,6.25 55.78,7.47 55.78,15.39 v55.47,15.7 | 58.67,19.36 v56.24,16.92
D4  (via drill 0.35)  (1 unrouted)
  Top 0.152: v34.29,25.3 32.61,25.3 U1.47 | v44.81,24.99 48.62,21.18 60.35,21.18 61.72,22.55 62.33,22.55 U2.41
  Bottom 0.152: v34.29,25.3 35.36,25.3 35.81,24.84 44.65,24.84 v44.81,24.99
D5  (via drill 0.35)  (1 unrouted)
  Top 0.152: v30.33,21.64 30.33,24.38 30.79,24.84 32.46,24.84 U1.46 | v33.53,18.75 33.53,19.05 34.14,19.66 37.49,19.66 v37.95,20.12 | v48.92,21.79 60.5,21.79 61.72,23.01 62.33,23.01 U2.42
  Bottom 0.152: v30.33,21.64 33.22,18.75 v33.53,18.75 | v37.95,20.12 39.62,21.79 v48.92,21.79
D6  (via drill 0.35)  (1 unrouted)
  Top 0.152: v33.68,24.38 32.61,24.38 U1.45 | v55.32,23.62 62.33,23.62 U2.43
  Bottom 0.152: v33.68,24.38 54.56,24.38 v55.32,23.62
D7  (via drill 0.35)  (1 unrouted)
  Top 0.152: v34.9,27.13 34.9,24.69 33.98,23.77 33.38,23.77 33.22,23.93 32.61,23.93 U1.44 | v51.97,24.99 60.96,24.99 61.87,24.08 62.33,24.08 U2.44
  Bottom 0.152: v34.9,27.13 37.95,30.18 46.79,30.18 v51.97,24.99
F_5VSB
  Top 0.152: 74.52,2.59 74.52,3.96 73.76,4.72 L1.1 | 74.52,2.59 74.52,1.52 C12.1 | 70.26,1.52 67.51,4.27 64.77,4.27 VR1.3 | 74.52,2.59 71.32,2.59 70.26,1.52 | 70.26,1.52 C14.1
GND  (via drill 0.35)  (3 unrouted)
  Top 0.152: U2.36 62.48,20.12 63.86,20.12 64.31,20.57 C9.2 64.47,20.73 64.47,21.03 65.23,21.79 65.23,24.23 62.94,26.52 46.79,26.52 43.13,30.18 37.95,30.18 35.81,28.04 35.81,24.08 v39.32,20.57 40.23,20.57 C8.2 | 41.15,18.9 40.39,18.14 40.39,16.61 R4.1 40.39,16.46 40.39,16.15 41.45,15.09 v41.45,14.33 | 41.15,18.9 42.37,20.12 42.82,20.12 U2.13 42.98,20.12 45.87,20.12 50.6,15.39 50.6,12.8 51.51,11.89 51.51,11.58 C11.1 | 41.15,18.9 v41,18.9 | 64.31,1.52 65.38,1.52 C13.2 | 64.31,1.52 58.67,1.52 C15.2 | 76.35,2.13 76.35,2.74 74.83,4.27 74.83,5.49 74.37,5.94 72.69,5.94 72.39,6.25 72.39,8.23 71.78,8.84 64.77,8.84 VR1.1 | 76.35,2.13 76.35,1.52 C12.2 | v73.46,1.98 73,1.52 72.08,1.52 C14.2 | 76.35,2.13 v77.42,2.13 | v64.31,1.98 64.31,1.52 | 26.98,24.38 28.04,24.38 29.87,26.21 29.87,26.52 U1.53 29.87,26.67 29.87,26.98 28.19,28.65 28.19,29.26 28.96,30.02 29.87,30.02 C6.1 | 26.98,24.38 26.67,24.38 24.99,26.06 24.99,26.52 U1.63 | C1.2 30.18,13.87 30.18,13.41 30.48,13.11 30.48,10.97 29.41,9.91 CRST.4 29.26,9.91 27.28,9.91 24.99,12.19 CRST.2 | 26.21,14.17 26.06,14.02 C2.2 | 26.21,14.17 27.13,15.09 27.13,16.46 26.98,16.61 26.98,17.68 U1.22 26.98,17.83 26.98,24.38 | 26.21,14.17 24.54,15.85 C5.1 | 26.21,14.17 C2.2 | CRST.2 24.99,12.34 24.99,12.95 25.91,13.87 C2.2 | 10.67,30.33 10.67,29.11 10.52,28.96 D2_ESD.1 10.36,28.8 10.36,27.58 D1_ESD.1 10.21,27.43 9.6,27.43 9.45,27.28 v7.77,27.28 | 10.67,30.33 10.67,32 GND.TP | 10.67,30.33 18.75,30.33 L2.1 | 19.81,21.03 21.95,21.03 C4.2 | 19.81,21.03 18.75,22.1 J3.S1 19.81,21.03 | 40.69,9.45 40.69,9.6 40.54,9.75 40.54,10.36 U4.2 40.39,10.52 40.39,10.97 39.93,11.43 37.19,11.43 36.88,11.12 36.88,9.14 Q2.2 36.73,9.14 35.66,9.14 v35.51,9.3
  Top 0.152: 40.69,9.45 40.69,8.69 U3.4 | 40.69,9.45 41.15,9.45 41.45,9.75 U4.4 | U1.6 23.62,23.47 21.79,23.47 19.51,25.76 R9.2 19.36,25.91 19.05,25.91 18.29,26.67 16.92,26.67 16.31,26.06 v15.54,26.06 | J3.8 8.84,24.54 8.84,24.23 6.86,22.25 6.25,22.25 J3.S2 6.1,22.1 4.72,20.73 | 4.72,20.73 4.42,20.42 3.2,20.42 J1.SH5 | 8.38,17.07 8.38,8.23 J2.S2 | 4.72,20.73 8.38,17.07 | v15.24,8.23 17.83,8.23 J2.S1 | 19.81,21.03 15.85,17.07 8.38,17.07 | v21.18,8.08 21.18,8.99 24.38,12.19 24.84,12.19 CRST.2
  Bottom 0.152: v41,18.9 v39.32,20.57 | v77.42,2.13 77.27,1.98 v73.46,1.98 v64.31,1.98 58.22,1.98 54.86,5.33 49.99,5.33 49.53,4.88 | 7.62,17.68 5.03,20.27 3.2,20.27 J1.SH5 3.05,20.42 3.05,24.69 J1.SH2 3.2,24.84 5.64,27.28 v7.77,27.28 | 7.62,17.68 8.23,17.07 8.23,14.48 14.48,8.23 v15.24,8.23 18.29,5.18 | v15.54,26.06 15.54,25.3 12.65,22.4 12.34,22.4 7.62,17.68 | 35.51,8.84 v35.51,9.3 | 35.51,8.84 30.02,3.35 20.12,3.35 18.29,5.18 | 18.29,5.18 v21.18,8.08 | 49.53,4.88 48.92,4.27 42.52,4.27 37.95,8.84 35.51,8.84 | v41.45,14.33 41.45,13.87 44.81,10.52 44.81,9.91 46.02,8.69 47.7,8.69 48.46,7.92 48.46,5.94 49.53,4.88
LED  (via drill 0.35)
  Top 0.152: v25.45,19.51 25.45,17.83 U1.19 | v13.11,21.18 12.65,21.18 10.97,22.86 10.97,24.54 J3.6 10.82,24.69 10.82,25.15 v9.91,26.06 | v14.02,30.94 14.78,31.7 14.78,32 LED.TP
  Bottom 0.152: v25.45,19.51 14.78,19.51 v13.11,21.18 | v14.02,30.94 17.07,27.89 17.68,27.89 17.98,28.19 17.98,28.8 16.46,30.33 16,30.33 14.33,32 9.3,32 6.4,29.11 5.18,29.11 4.88,28.8 4.88,28.19 5.18,27.89 8.08,27.89 v9.91,26.06
N$1
  Top 0.152: U1.4 23.62,24.38 22.25,24.38 20.57,26.06 20.57,28.35 19.51,29.41 17.07,29.41 16.76,29.72 15.7,29.72 15.39,29.41 15.39,28.19 16.15,27.43 R5.2
N$2
  Top 0.152: R2.1 34.29,13.87 35.51,13.87 35.81,14.17 Q3.B 35.81,14.33 35.81,15.54 33.68,17.68 | 33.68,17.68 34.59,18.59 R3.2 | 33.68,17.68 32.92,16.92 32.92,15.85 C3.1
N$3
  Top 0.152: U1.7 23.62,22.86 22.25,22.86 22.1,22.71 C4.1
N$4
  Top 0.152: U1.5 23.62,23.93 22.25,23.93 20.27,25.91 20.27,26.52 19.2,27.58 17.37,27.58 16.31,28.65 R6.2
N$6  (1 unrouted)
N$7
  Top 0.152: R10.1 43.59,6.1 43.59,5.03 42.37,3.81 Q1.2
N$8
  Top 0.152: L1.2 73.76,6.86 73.76,8.23 74.37,8.84 5VSB.TP
N$20
  Top 0.152: U3.5 40.69,5.18 41,4.88 41.3,4.88 41.6,5.18 41.6,5.79 U3.7
N$32
  Top 0.152: U4.3 41,10.52 41,10.97 41.3,11.28 41.6,11.28 42.82,10.06 42.82,9.3 42.22,8.69 U3.1
N$33
  Top 0.152: R11.2 37.8,12.34 40.23,12.34 40.39,12.5 40.39,13.11 U4.7
N$34
  Top 0.152: R11.1 37.8,10.52 37.8,8.23 36.88,7.32 Q2.1
N$36
  Top 0.152: U4.5 41.45,13.26 41,13.26 U4.6 40.84,13.26 40.84,13.87 40.39,14.33 40.39,14.78 R4.2 40.23,14.94 39.47,14.94 38.1,16.31 36.88,16.31 Q3.C 36.73,16.46 36.42,16.76 36.42,18.59 R3.1
N$37
  Top 0.152: J1.1 2.59,23.93 3.96,23.93 7.16,27.13 7.16,29.57 SW1.1
NAND_BTN  (via drill 0.35)
  Top 0.152: v22.4,17.07 24.54,17.07 24.84,17.37 24.84,17.68 U1.18 | 13.26,20.12 10.06,23.32 10.06,24.54 J3.7 | 13.26,20.12 v15.54,17.83 | v17.68,24.54 17.68,25.76 R9.1 | 13.26,20.12 v15.85,22.71
  Bottom 0.152: v22.4,17.07 16.31,17.07 v15.54,17.83 | v15.85,22.71 v17.68,24.54
OE  (via drill 0.35)
  Top 0.152: v39.93,9.14 39.93,10.36 U4.1 | v42.22,9.75 41.76,9.3 41.76,8.69 U3.2 | v35.2,23.16 34.44,22.4 32.61,22.4 U1.41 | v52.73,13.56 52.73,10.36 52.88,10.21 52.88,9.91 52.43,9.45 51.82,9.45 U5.19 51.66,9.3 50.9,9.3 48.62,7.01 v48.62,4.88
  Bottom 0.152: v39.93,9.14 41.6,9.14 v42.22,9.75 42.67,9.75 47.55,4.88 v48.62,4.88 | v35.2,23.16 48.46,23.16 52.73,18.9 v52.73,13.56
P_GND  (via drill 0.35)
  Top 0.152: v4.27,21.34 2.59,21.34 J1.5 | v11.58,23.16 11.58,24.23 11.89,24.54 J3.5 | v17.37,28.5 18.75,28.5 L2.2 | v9.14,27.89 v9.14,29.11
  Bottom 0.152: 7.16,21.34 9.75,21.34 v11.58,23.16 | 7.16,21.34 v4.27,21.34 | v17.37,28.5 14.17,31.7 11.73,31.7 v9.14,29.11 | v9.14,27.89 10.52,26.52 10.52,25.76 9.45,24.69 7.47,24.69 7.16,24.38 7.16,21.34
RB
  Top 0.152: U1.40 32.61,21.95 34.44,21.95 34.9,22.4 36.58,22.4 39.32,19.66 41,19.66 41.15,19.81 41.15,21.18 41,21.34 39.78,21.34 39.62,21.49 39.62,22.86 39.93,23.16 42.82,23.16 U2.7 42.98,23.01 45.26,23.01 57.61,10.67 57.76,10.67 58.98,9.45 58.98,8.84 58.22,8.08 57.91,8.08 56.84,7.01 56.84,6.4 57,6.25 57,6.1 57.76,5.33 57.76,4.72 RB1.TP
RE  (via drill 0.35)
  Top 0.152: v53.95,10.97 53.95,13.26 44.65,22.55 42.98,22.55 U2.8 | RE.TP 56.08,5.64 v54.56,7.16 53.65,6.25 51.82,6.25 U5.14
  Bottom 0.152: v53.95,10.97 54.56,10.36 v54.56,7.16
RE_MC  (via drill 0.35)
  Top 0.152: v35.2,21.79 36.73,21.79 37.03,21.49 37.03,20.88 36.12,19.96 33.98,19.96 33.53,19.51 32.61,19.51 U1.35 | v47.4,6.86 46.02,6.86 U5.6
  Bottom 0.152: v35.2,21.79 35.2,21.03 35.05,20.88 35.05,19.36 44.2,10.21 44.2,9.6 46.94,6.86 v47.4,6.86
RST  (via drill 0.35)
  Top 0.152: v24.69,23.62 26.06,22.25 26.06,19.2 25.91,19.05 25.91,17.83 U1.20 | v16.46,30.94 16.46,31.55 16.92,32 RST.TP
  Bottom 0.152: v24.69,23.62 21.79,26.52 21.79,26.67 17.53,30.94 v16.46,30.94
RX_UART  (via drill 0.35)
  Top 0.152: v30.94,9.6 30.94,14.48 29.41,16 29.41,17.68 U1.27 | v27.74,4.88 26.21,3.35 26.21,1.22 RX_UART.TP
  Bottom 0.152: v30.94,9.6 30.94,9.3 31.24,8.99 31.24,5.94 30.18,4.88 v27.74,4.88
SBR  (via drill 0.35)
  Top 0.152: v27.28,12.8 27.28,14.17 28.35,15.24 28.35,17.68 U1.25 | v22.55,9.45 22.55,1.52 22.86,1.22 SBR_EJ/PO.TP
  Bottom 0.152: v27.28,12.8 23.77,9.3 22.71,9.3 v22.55,9.45
TCK_CR  (via drill 0.35)
  Top 0.152: v30.79,16 30.79,17.68 U1.30 | v29.57,4.27 29.57,3.5 30.02,3.05 TCK_CR.TP | v12.04,12.04 11.28,11.28 11.28,10.67 J2.5
  Bottom 0.152: v30.79,16 30.79,14.94 25.76,9.91 25.76,8.84 | 25.76,8.84 25.76,5.94 27.43,4.27 v29.57,4.27 | v12.04,12.04 14.94,9.14 21.95,9.14 22.25,8.84 25.76,8.84
TCK_MC  (via drill 0.35)
  Top 0.152: v26.36,25.6 27.28,25.6 27.89,26.21 27.89,26.52 U1.57 | v21.03,30.63 21.03,31.85 20.88,32 TCK_MC.TP
  Bottom 0.152: v26.36,25.6 23.77,25.6 21.03,28.35 v21.03,30.63
TD0_MC
  Top 0.152: U1.55 28.8,26.67 28.8,27.58 27.89,28.5 27.89,29.72 25.3,32.31 TDO_MC.TP
TDI_CR  (via drill 0.35)  (1 unrouted)
  Top 0.152: v30.79,18.75 31.39,18.14 31.39,17.83 U1.31 | v15.85,13.87 13.26,11.28 13.26,10.67 J2.3
  Bottom 0.152: v30.79,18.75 29.87,18.75 24.99,13.87 v15.85,13.87
TDI_MC  (via drill 0.35)
  Top 0.152: v27.13,24.99 28.19,24.99 29.41,26.21 29.41,26.52 U1.54 | v26.67,32.92 27.58,32 TDI_MC.TP
  Bottom 0.152: v27.13,24.99 23.93,24.99 19.2,29.72 19.2,33.22 19.81,33.83 25.76,33.83 v26.67,32.92
TDO_CR  (via drill 0.35)
  Top 0.152: v30.33,20.12 31.85,18.59 31.85,17.83 U1.32 | v32.16,6.86 32.16,5.79 34.29,3.66 TDO_CR.TP | v13.11,12.04 12.19,11.12 12.19,10.67 J2.4
  Bottom 0.152: v32.16,6.86 32.16,18.75 30.79,20.12 v30.33,20.12 27.43,20.12 23.77,16.46 17.53,16.46 15.24,14.17 15.24,13.56 16.61,12.19 16.61,10.21 16.31,9.91 15.7,9.91 13.56,12.04 v13.11,12.04
TMS_CR  (via drill 0.35)  (1 unrouted)
  Top 0.152: v29.11,19.36 30.33,18.14 30.33,17.83 U1.29 | v18.44,14.48 17.98,14.48 15.24,11.73 14.78,11.73 14.17,11.12 14.17,10.67 J2.2
  Bottom 0.152: v29.11,19.36 27.13,19.36 22.25,14.48 v18.44,14.48
TMS_MC  (via drill 0.35)
  Top 0.152: v26.98,29.72 27.58,29.11 27.58,28.35 28.35,27.58 28.35,26.67 U1.56 | v23.93,33.22 23.93,32.77 23.32,32.16 TMS_MC.TP
  Bottom 0.152: v26.98,29.72 26.06,29.72 23.93,31.85 v23.93,33.22
TST  (via drill 0.35)
  Top 0.152: v26.98,28.8 27.28,28.5 27.28,26.67 U1.58 | v19.81,32.92 19.51,32.92 18.75,32.16 TST.TP
  Bottom 0.152: v26.98,28.8 23.93,28.8 v19.81,32.92
TX_UART
  Top 0.152: U1.28 29.87,17.68 29.87,16 31.55,14.33 31.55,6.25 30.18,4.88 29.26,4.88 27.58,3.2 TX_UART.TP
USB_D+  (via drill 0.35)
  Top 0.152: 13.26,28.8 12.34,28.8 D2_ESD.2 | 13.26,28.8 14.48,28.8 R6.1 | v7.77,24.08 5.03,24.08 3.66,22.71 2.59,22.71 J1.3 | v12.5,23.16 12.5,24.23 12.8,24.54 J3.4 | v13.26,28.19 13.26,28.8
  Bottom 0.152: 11.58,24.08 v7.77,24.08 | v12.5,23.16 11.58,24.08 | v13.26,28.19 13.26,25.76 11.58,24.08
USB_D-
  Top 0.152: 14.02,27.43 12.19,27.43 D1_ESD.2 12.04,27.43 11.28,26.67 7.16,26.67 3.81,23.32 2.59,23.32 J1.2 | 14.02,27.43 14.48,27.43 R5.1 14.02,27.43 | 14.02,27.43 14.02,24.69 J3.3
USB_VB
  Top 0.152: U1.8 23.62,22.4 23.16,22.4 22.55,21.79 21.34,21.79 20.27,22.86 20.27,23.62 20.12,23.77 16.61,23.77 16.31,23.47 15.54,23.47 14.94,24.08 14.94,24.54 J3.2
VCC  (via drill 0.35)  (1 unrouted)
  Top 0.152: R1.2 40.84,2.59 40.84,3.96 41.76,4.88 41.91,4.88 42.22,5.18 42.22,5.79 U3.8 42.22,5.94 42.82,6.55 42.82,6.71 42.98,6.86 44.35,6.86 44.96,6.25 44.96,3.81 45.11,3.66 46.79,3.66 47.85,4.72 | 40.84,21.95 40.69,22.1 40.39,22.1 C8.1 40.84,21.95 | 40.84,21.95 42.22,20.57 42.82,20.57 U2.12 42.98,20.57 45.87,20.57 51.51,14.94 51.51,13.41 C11.2 51.66,13.26 51.66,12.95 52.43,12.19 52.43,10.67 51.82,10.06 U5.20 51.66,9.91 50.9,9.91 48.01,7.01 48.01,4.88 47.85,4.72 | C9.1 64.47,22.25 62.79,20.57 62.48,20.57 U2.37 62.33,20.57 59.59,20.57 56.84,17.83 56.84,13.87 58.06,12.65 58.52,12.65 59.28,11.89 59.28,3.81 | 63.7,3.81 63.7,4.88 64.62,5.79 64.62,6.55 VR1.2 | 63.7,3.81 64.92,2.59 66.29,2.59 67.21,1.68 C13.1 | 63.7,3.81 59.28,3.81 | 59.28,3.81 59.13,3.81 57.61,2.29 57.61,2.13 57,1.52 C15.1 56.84,1.52 54.71,1.52 53.03,3.2 49.38,3.2 47.85,4.72 | v5.49,28.5 4.42,29.57 SW1.2 | v12.04,31.09 12.95,32 VCC.TP 13.11,32.16 13.41,32.16 14.78,33.53 20.73,33.53 21.79,32.46 21.79,29.72 C7.1 21.95,29.57 22.86,29.57 24.38,28.04 24.38,26.67 U1.64 24.38,26.52 24.38,25.15 24.23,24.99 | v16.76,24.99 16.46,24.69 16,24.69 J3.1 | U4.8 39.93,13.26 38.71,13.26 37.8,14.17 Q3.E 37.8,14.33 37.8,15.39 v37.95,15.54 | U1.52 30.33,26.67 30.33,28.04 30.02,28.35 C6.2 29.87,28.5 29.26,28.5 v28.8,28.96 | C5.2 26.21,16 26.36,16.15 26.36,17.68 U1.21 26.36,17.83 26.36,22.86 v26.21,23.01 24.23,24.99 | 24.23,24.99 23.77,24.99 U1.3 | v41.45,22.55 40.84,21.95
  Bottom 0.152: v5.49,28.5 9.45,28.5 11.73,30.79 | v12.04,31.09 11.73,30.79 | v16.76,24.99 16.76,25.76 11.73,30.79 | v28.8,28.96 28.8,25.6 28.5,25.3 | v26.21,23.01 28.5,25.3 | v37.95,15.54 37.95,15.85 33.53,20.27 | 28.5,25.3 33.53,20.27 | v41.45,22.55 35.05,22.55 34.14,21.64 34.14,20.88 33.53,20.27
WE  (via drill 0.35)
  Top 0.152: v49.23,14.94 46.63,17.53 42.98,17.53 U2.18 | v53.19,8.08 51.82,8.08 U5.17 | v53.34,9.3 54.1,9.3 54.86,10.06 56.08,10.06 WE1.TP
  Bottom 0.152: v49.23,14.94 50.6,13.56 50.6,8.69 49.68,7.77 49.68,7.16 49.99,6.86 51.97,6.86 v53.19,8.08 53.34,8.23 v53.34,9.3
WE_MC  (via drill 0.35)
  Top 0.152: v33.53,21.34 33.22,21.03 32.61,21.03 U1.38 | v48.31,8.99 46.94,8.99 46.79,8.84 46.02,8.84 U5.3
  Bottom 0.152: v33.53,21.34 33.53,22.4 34.9,23.77 48.31,23.77 56.08,16 56.08,6.86 54.86,5.64 49.38,5.64 48.77,6.25 48.77,8.53 v48.31,8.99
WP  (via drill 0.35)
  Top 0.152: v46.33,16.92 46.18,17.07 42.98,17.07 U2.19 | v52.12,17.07 52.73,17.07 58.06,11.73 WP1.TP | v55.17,9.3 54.56,8.69 51.82,8.69 U5.18
  Bottom 0.152: 51.97,16.92 v46.33,16.92 | v55.17,9.3 55.17,10.67 52.88,12.95 52.43,12.95 51.97,13.41 51.97,16.92 | 51.97,16.92 v52.12,17.07
WP_MC  (via drill 0.35)
  Top 0.152: v31.55,21.34 32.46,21.34 U1.39 | v41.45,12.04 42.52,12.04 43.74,13.26 43.74,14.94 44.04,15.24 44.65,15.24 44.96,14.94 44.96,13.26 44.81,13.11 44.81,9.91 45.26,9.45 45.87,9.45 U5.2
  Bottom 0.152: v31.55,21.34 31.85,21.34 37.34,15.85 37.34,15.24 40.54,12.04 v41.45,12.04
X0
  Top 0.152: U1.61 25.91,26.67 25.91,27.89 22.1,31.7 22.1,32.46 23.47,33.83 26.06,33.83 26.82,34.59 26.82,36.12 X0.TP
X1
  Top 0.152: U1.60 26.36,26.67 26.36,28.04 24.23,30.18 24.23,32.61 25.15,33.53 27.43,33.53 28.5,34.59 X1.TP
X2  (via drill 0.35)
  Top 0.152: v26.21,30.48 26.21,28.65 26.82,28.04 26.82,26.67 U1.59 | v30.18,34.44 30.18,36.12 X2.TP
  Bottom 0.152: v30.18,34.44 v26.21,30.48
X3  (via drill 0.35)
  Top 0.152: v31.55,23.32 31.85,23.01 32.46,23.01 U1.42 | v33.22,32.31 33.22,33.38 32,34.59 X3.TP
  Bottom 0.152: v31.55,23.32 31.55,30.63 v33.22,32.31
X4  (via drill 0.35)
  Top 0.152: v30.94,24.08 30.94,20.12 32.16,18.9 32.46,18.9 U1.34 | v33.53,34.75 33.53,36.12 X4.TP
  Bottom 0.152: v30.94,24.08 30.94,30.94 33.53,33.53 v33.53,34.75
X5
  Top 0.152: U1.43 32.61,23.47 34.14,23.47 35.51,24.84 35.51,28.19 38.71,31.39 44.5,31.39 46.94,33.83 46.94,34.59 46.33,35.2 35.81,35.2 35.36,34.75 X5.TP
X6/SYNC  (via drill 0.35)
  Top 0.152: v25.45,21.95 23.77,21.95 U1.9 | v30.18,25.6 v28.65,24.08 | v35.81,35.97 36.88,35.97 37.03,36.12 X6/SYNC.TP
  Bottom 0.152: v25.45,21.95 26.52,21.95 v28.65,24.08 | v30.18,25.6 30.18,30.63 32.92,33.38 32.92,35.05 33.83,35.97 v35.81,35.97
X7  (via drill 0.35)
  Top 0.152: v23.62,26.67 23.62,25.91 U1.1 | v30.33,31.7 43.28,31.7 45.72,34.14 X7_KIOSK.TP
  Bottom 0.152: v23.62,26.67 26.21,26.67 28.19,28.65 28.19,29.57 v30.33,31.7
X8  (via drill 0.35)
  Top 0.152: v23.77,27.74 23.01,26.98 23.01,25.76 23.32,25.45 23.62,25.45 U1.2 | v46.94,36.42 47.4,36.42 48.01,35.81 X8.TP
  Bottom 0.152: v23.77,27.74 26.82,27.74 27.89,28.8 27.89,30.48 33.98,36.58 46.79,36.58 v46.94,36.42
XTAL1  (via drill 0.35)
  Top 0.152: v27.58,18.75 27.89,18.44 27.89,17.83 U1.24 | v23.62,14.94 23.62,14.63 24.23,14.02 C2.1 | v26.52,9.75 24.99,9.75 CRST.3
  Bottom 0.152: v23.62,14.94 23.77,14.94 v27.58,18.75 29.41,18.75 30.02,19.36 31.09,19.36 31.39,19.05 31.39,15.09 26.52,10.21 v26.52,9.75
XTAL2
  Top 0.152: 28.35,12.19 29.26,12.19 CRST.1 | 28.35,12.19 26.98,12.19 26.67,12.5 26.67,13.11 26.82,13.26 26.82,14.17 27.43,14.78 27.43,17.68 U1.23 | 28.35,12.19 28.35,13.87 C1.1
Y0  (via drill 0.35)
  Top 0.152: v24.69,21.34 23.77,21.34 U1.10 | v12.04,14.78 8.99,11.73 8.99,10.67 9.91,9.75 9.91,3.66 9.3,3.05 9.3,1.22 Y0.TP
  Bottom 0.152: v24.69,21.34 13.87,21.34 13.41,21.79 12.8,21.79 12.04,21.03 v12.04,14.78
Y1
  Top 0.152: U1.11 23.62,20.88 23.32,20.88 22.71,20.27 22.71,20.12 17.37,14.78 13.41,14.78 10.21,11.58 10.21,2.9 10.36,2.74 Y1.TP
Y2
  Top 0.152: U1.12 23.62,20.42 23.32,20.42 23.01,20.12 23.01,19.96 17.53,14.48 13.56,14.48 10.52,11.43 10.52,4.12 11.58,3.05 11.58,1.22 Y2.TP
Y3
  Top 0.152: U1.13 23.62,19.81 23.32,19.81 19.66,16.15 19.66,6.86 16.61,3.81 14.48,3.81 13.41,2.74 Y3.TP
Y4  (via drill 0.35)
  Top 0.152: v24.69,20.12 24.69,19.96 24.23,19.51 23.77,19.51 U1.14 | v19.81,20.12 19.36,20.12 14.33,15.09 13.26,15.09 v9.6,11.43 | v17.37,3.66 17.37,2.44 16.15,1.22 15.09,1.22 Y4.TP
  Bottom 0.152: v19.81,20.12 v24.69,20.12 | v17.37,3.66 v9.6,11.43
Y5  (via drill 0.35)
  Top 0.152: v24.69,18.9 23.77,18.9 U1.15 | v16,10.52 16,9.91 12.19,6.1 12.19,2.29 12.8,1.68 14.02,1.68 15.09,2.74 16.15,2.74 Y5.TP
  Bottom 0.152: v24.69,18.9 15.7,18.9 14.94,18.14 14.94,11.58 v16,10.52
Y6
  Top 0.152: U1.16 23.62,18.29 22.25,18.29 19.96,16 19.96,5.03 17.98,3.05 17.98,1.37 Y6.TP
Y7
  Top 0.152: U1.17 24.38,17.68 22.1,17.68 20.57,16.15 20.57,4.42 Y7.TP